# Altium schematic sheet Debug.SchDoc
size A
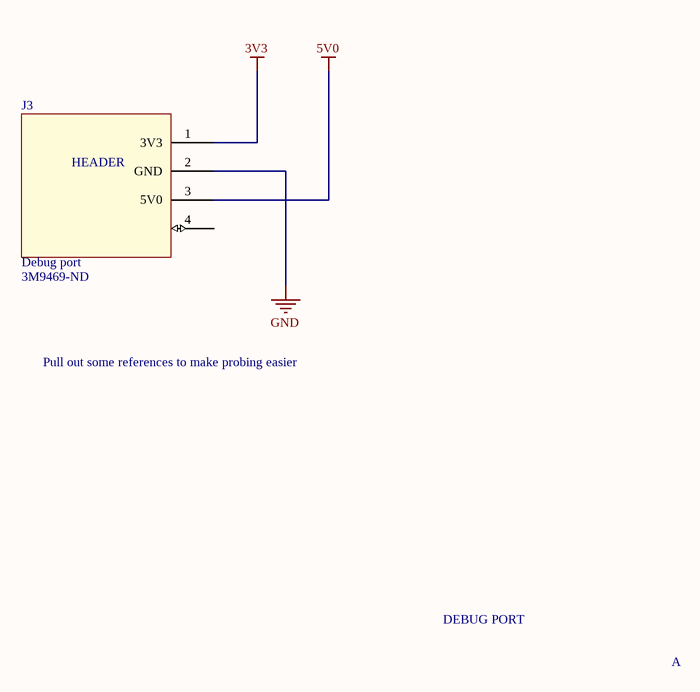
[diagram p0: Debug.SchDoc]

## Parts
J3  Debug port  Supplier Part Number 1: 3M9469-ND  [HEADER_4POS_DEBUG]

## Nets
3V3: J3.1(3V3)
5V0: J3.3(5V0)
GND: J3.2(GND)

Not connected (* = marked no-connect by the designer): J3 4

## Notes on the sheet
- Pull out some references to make probing easier
- DEBUG PORT
- A
- (in symbol CONN HEADER R/A SGL 4POS GOLD (debug)) HEADER

## Library data of the parts
J3 = CONN HEADER R/A SGL 4POS GOLD (debug): http://multimedia.3m.com/mws/media/548122O/3mtm-pin-strip-header-ts2182.pdf; Supplier 1: Digi-Key